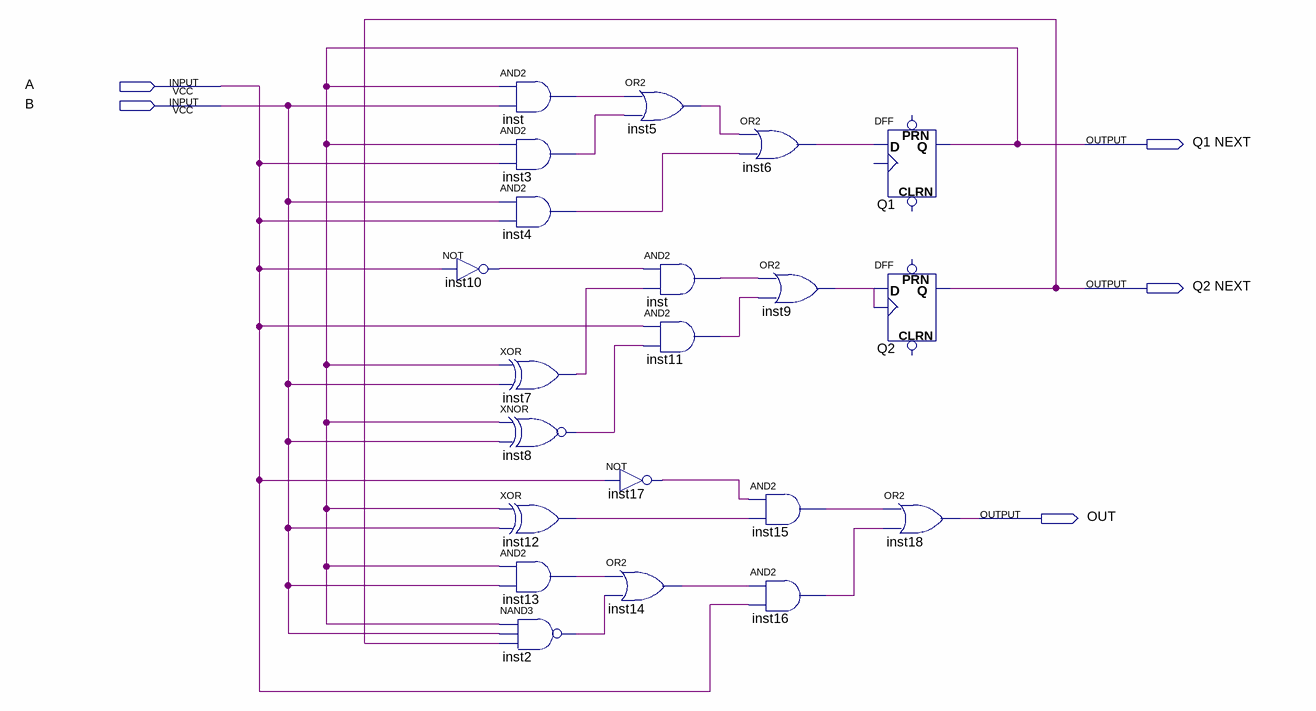
[diagram p0: schematic sheet]
// Quartus schematic problem6.bdf as structural Verilog: 21 symbols, 5 pins
module problem6 (
  input  A,
  input  B,
  output \Q1_NEXT ,
  output \Q2_NEXT ,
  output OUT
);

  wire inst2_out, inst3_out, inst4_out, inst5_out, inst6_out, inst7_out, inst8_out, inst9_out, inst10_out,
       inst11_out, inst12_out, inst13_out, inst14_out, inst15_out, inst16_out, inst17_out, inst_out,
       inst_out_2;

  not inst10 (inst10_out, A);
  and inst (inst_out, \Q1_NEXT , B);
  and inst3 (inst3_out, \Q1_NEXT , A);
  and inst4 (inst4_out, B, A);
  xor inst7 (inst7_out, \Q1_NEXT , B);
  xnor inst8 (inst8_out, \Q1_NEXT , B);
  xor inst12 (inst12_out, \Q1_NEXT , B);
  and inst13 (inst13_out, \Q1_NEXT , B);
  nand inst2 (inst2_out, \Q1_NEXT , B, \Q2_NEXT );
  or inst5 (inst5_out, inst_out, inst3_out);
  and inst_dup2 (inst_out_2, inst10_out, inst7_out);
  and inst11 (inst11_out, A, inst8_out);
  not inst17 (inst17_out, A);
  or inst14 (inst14_out, inst13_out, inst2_out);
  or inst6 (inst6_out, inst5_out, inst4_out);
  or inst9 (inst9_out, inst_out_2, inst11_out);
  and inst15 (inst15_out, inst17_out, inst12_out);
  and inst16 (inst16_out, inst14_out, A);
  DFF Q1 (.D(inst6_out), .Q(\Q1_NEXT ));  // open: CLRN, CLK, PRN
  DFF Q2 (.CLK(inst9_out), .D(inst9_out), .Q(\Q2_NEXT ));  // open: CLRN, PRN
  or inst18 (OUT, inst15_out, inst16_out);
endmodule
